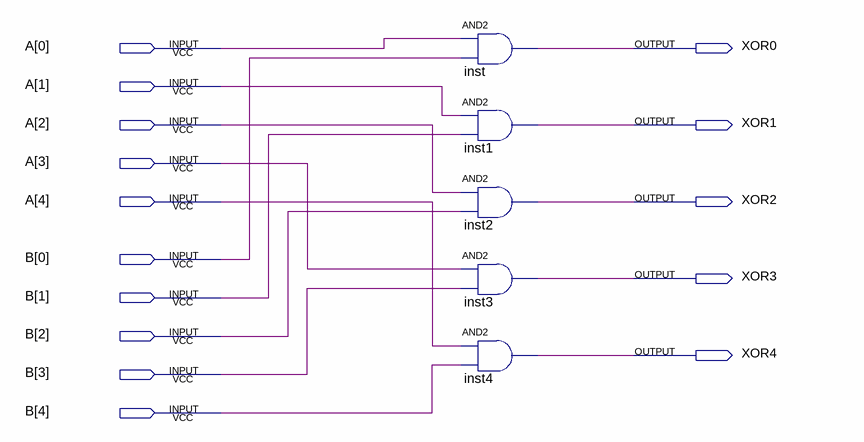
[diagram p0: schematic sheet]
// Quartus schematic AANDB.bdf as structural Verilog: 5 symbols, 15 pins
module AANDB (
  input  [4:0] A,
  input  [4:0] B,
  output XOR0,
  output XOR1,
  output XOR2,
  output XOR3,
  output XOR4
);

  and inst (XOR0, A[0], B[0]);
  and inst1 (XOR1, A[1], B[1]);
  and inst2 (XOR2, A[2], B[2]);
  and inst3 (XOR3, A[3], B[3]);
  and inst4 (XOR4, A[4], B[4]);
endmodule
